# Altium schematic sheet LED_driver.SchDoc
size A4
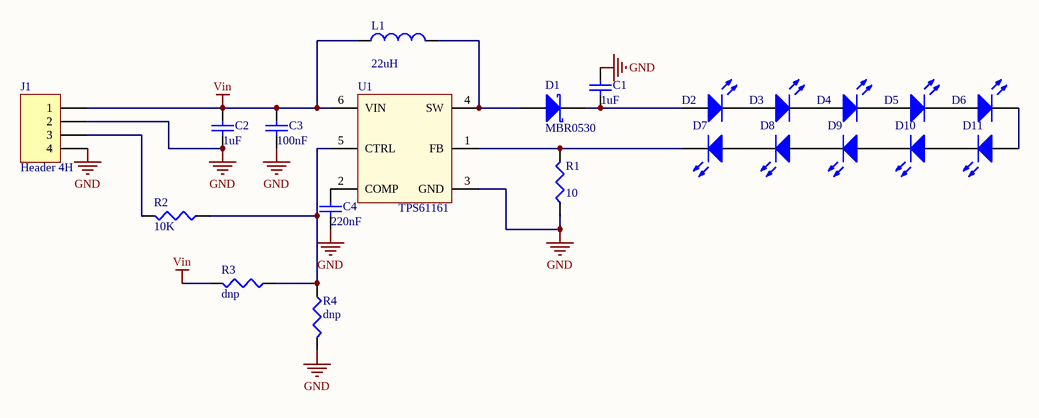
[diagram p0: LED_driver.SchDoc]

## Parts
C1  value 1uF  [C0805]  (hidden comment: Cap Semi)
C2  value 1uF  [C0805]  (hidden comment: Cap Semi)
C3  value 100nF  [C0805]  (hidden comment: Cap Semi)
C4  value 220nF  [C0805]  (hidden comment: Cap Semi)
D1  MBR0530  [SOD_123]
D2  LED2  [LED_0805]  (value not drawn)
D3  LED2  [LED_0805]  (value not drawn)
D4  LED2  [LED_0805]  (value not drawn)
D5  LED2  [LED_0805]  (value not drawn)
D6  LED2  [LED_0805]  (value not drawn)
D7  LED2  [LED_0805]  (value not drawn)
D8  LED2  [LED_0805]  (value not drawn)
D9  LED2  [LED_0805]  (value not drawn)
D10  LED2  [LED_0805]  (value not drawn)
D11  LED2  [LED_0805]  (value not drawn)
J1  Header 4H  [HDR2X2]
L1  value 22uH  [5020]  (hidden comment: Inductor)
R1  value 10  [J1-0603]  (hidden comment: Res3)
R2  value 10K  [J1-0603]  (hidden comment: Res3)
R3  value dnp  [J1-0603]  (hidden comment: Res3)
R4  value dnp  [J1-0603]  (hidden comment: Res3)
U1  TPS61161  [SON6]

## Nets
GND: C1.2 C2.1 C3.1 C4.1 J1.2 J1.4 R1.1 R4.2 U1.3(GND)
Vin: C2.2 C3.2 J1.1 L1.1 R3.2 U1.6(VIN)
NetC1_1: C1.1 D1.2(K) D2.1(A)
NetC4_2: C4.2 U1.2(COMP)
NetD1_1: D1.1(A) L1.2 U1.4(SW)
NetD2_2: D2.2(K) D3.1(A)
NetD3_2: D3.2(K) D4.1(A)
NetD4_2: D4.2(K) D5.1(A)
NetD5_2: D5.2(K) D6.1(A)
NetD6_2: D6.2(K) D11.1(A)
NetD7_1: D7.1(A) D8.2(K)
NetD7_2: D7.2(K) R1.2 U1.1(FB)
NetD8_1: D8.1(A) D9.2(K)
NetD9_1: D9.1(A) D10.2(K)
NetD10_1: D10.1(A) D11.2(K)
NetJ1_3: J1.3 R2.2
NetR2_1: R2.1 R3.1 R4.1 U1.5(CTRL)

## Library data of the parts
C1-C4 = Cap Semi: Capacitor (Semiconductor SIM Model); Published: 8-Jun-2000; LatestRevisionDate: 29-May-2009; LatestRevisionNote: IPC-7351 Footprint Added.; PackageReference: C1206; Publisher: Altium Limited; PackageDescription: Chip Capacitor
D1 = D Schottky: Schottky Diode; Published: 8-Jun-2000; LatestRevisionDate: 17-Jul-2002; LatestRevisionNote: Re-released for DXP Platform.; PackageReference: SMB; Publisher: Altium Limited; PackageDescription: DO-214-AA/SMB; 2 C-Bend Leads; Body 5.3 x 3.6 mm, inc. leads (LxW); Code_JEDEC: DO-214-AA
D2-D11 = LED2: Typical RED, GREEN, YELLOW, AMBER GaAs LED; Published: 8-Jun-2000; LatestRevisionDate: 17-Jul-2002; LatestRevisionNote: Re-released for DXP Platform.; PackageVersion: Feb-2002; PackageReference: 3.2X1.6X1.1; Publisher: Altium Limited; PackageDescription: SM LED; 2 Flat Leads
J1 = Header 4H: Header, 4-Pin, Right Angle; LatestRevisionDate: 17-Jul-2002; LatestRevisionNote: Re-released for DXP Platform.; Publisher: Altium Limited
L1 = Inductor: Code_IEC: 1005; Published: 8-Jun-2000; LatestRevisionDate: 29-May-2009; LatestRevisionNote: IPC-7351 Footprint Added.; PackageReference: 0402-A; Publisher: Altium Limited; PackageDescription: Chip Inductor; Code_JEITA: 0402
R1-R4 = Res3: Resistor; Published: 8-Jun-2000; LatestRevisionDate: 29-May-2009; LatestRevisionNote: IPC-7351 Footprint Added.; PackageReference: J1-0603; Publisher: Altium Limited; PackageDescription: Chip Resistor